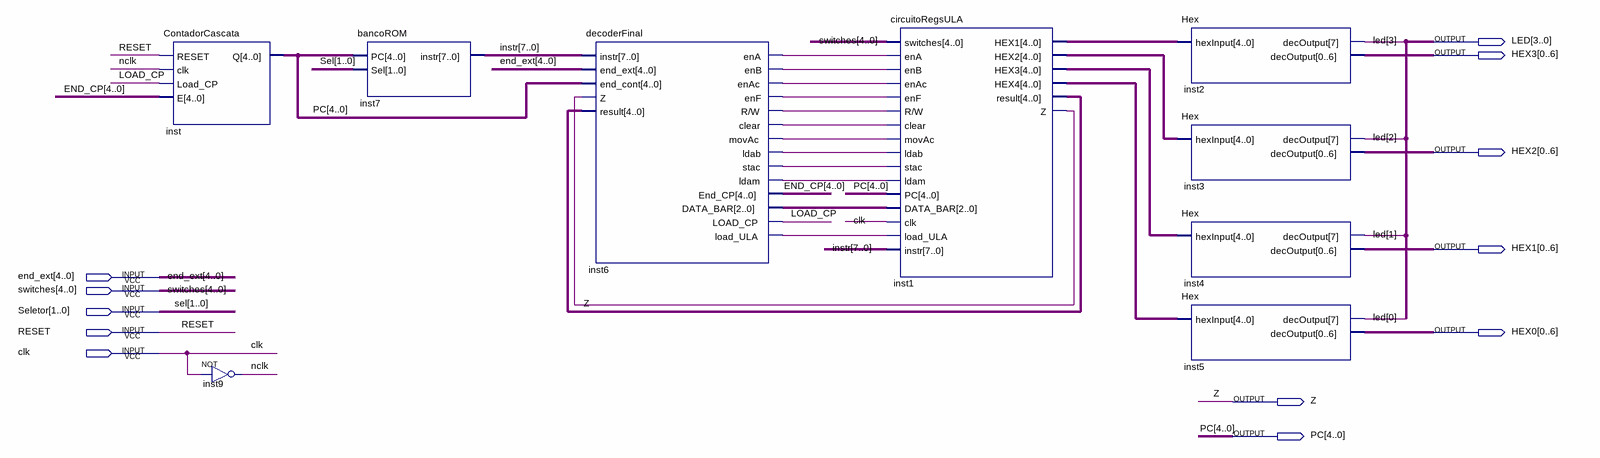
[diagram p0: schematic sheet]
// Quartus schematic CircuitoFinal.bdf as structural Verilog: 9 symbols, 12 pins
module CircuitoFinal (
  input  [4:0] end_ext,
  input  [4:0] switches,
  input  [1:0] Seletor,
  input  RESET,
  input  clk,
  output [3:0] LED,
  output [0:6] HEX3,
  output [0:6] HEX2,
  output [0:6] HEX1,
  output [0:6] HEX0,
  output Z,
  output [4:0] PC
);

  wire inst6_clear, inst6_ena, inst6_enac, inst6_enb, inst6_enf, inst6_ldab, inst6_ldam, inst6_load_ula,
       inst6_movac, inst6_r_w, inst6_stac, LOAD_CP, nclk;
  wire [2:0] inst6_data_bar;
  wire [4:0] END_CP, inst1_hex1, inst1_hex2, inst1_hex3, inst1_hex4, inst1_result;
  wire [7:0] instr;

  ContadorCascata inst (.RESET(RESET), .clk(nclk), .Load_CP(LOAD_CP), .E(END_CP), .Q(PC));
  not inst9 (nclk, clk);
  bancoROM inst7 (.PC(PC), .Sel(Seletor), .instr(instr));
  decoderFinal inst6 (
    .instr(instr), .end_ext(end_ext), .end_cont(PC), .Z(Z), .result(inst1_result), .enA(inst6_ena),
    .enB(inst6_enb), .enAc(inst6_enac), .enF(inst6_enf), .\R/W (inst6_r_w), .clear(inst6_clear),
    .movAc(inst6_movac), .ldab(inst6_ldab), .stac(inst6_stac), .ldam(inst6_ldam), .End_CP(END_CP),
    .DATA_BAR(inst6_data_bar), .LOAD_CP(LOAD_CP), .load_ULA(inst6_load_ula));
  circuitoRegsULA inst1 (
    .switches(switches), .enA(inst6_ena), .enB(inst6_enb), .enAc(inst6_enac), .enF(inst6_enf),
    .\R/W (inst6_r_w), .clear(inst6_clear), .movAc(inst6_movac), .ldab(inst6_ldab), .stac(inst6_stac),
    .ldam(inst6_ldam), .PC(PC), .DATA_BAR(inst6_data_bar), .clk(clk), .load_ULA(inst6_load_ula),
    .instr(instr), .HEX1(inst1_hex1), .HEX2(inst1_hex2), .HEX3(inst1_hex3), .HEX4(inst1_hex4),
    .result(inst1_result), .Z(Z));
  Hex inst2 (
    .hexInput(inst1_hex1), .decOutput({LED[3], HEX3[6], HEX3[5], HEX3[4], HEX3[3], HEX3[2], HEX3[1], HEX3[0]}));
  Hex inst3 (
    .hexInput(inst1_hex2), .decOutput({LED[2], HEX2[6], HEX2[5], HEX2[4], HEX2[3], HEX2[2], HEX2[1], HEX2[0]}));
  Hex inst4 (
    .hexInput(inst1_hex3), .decOutput({LED[1], HEX1[6], HEX1[5], HEX1[4], HEX1[3], HEX1[2], HEX1[1], HEX1[0]}));
  Hex inst5 (
    .hexInput(inst1_hex4), .decOutput({LED[0], HEX0[6], HEX0[5], HEX0[4], HEX0[3], HEX0[2], HEX0[1], HEX0[0]}));

  // Other names for the same wires on the sheet: Sel[1:0] = Seletor
endmodule
